# EAGLE schematic CHAIRI2C (EAGLE 9.6.2)
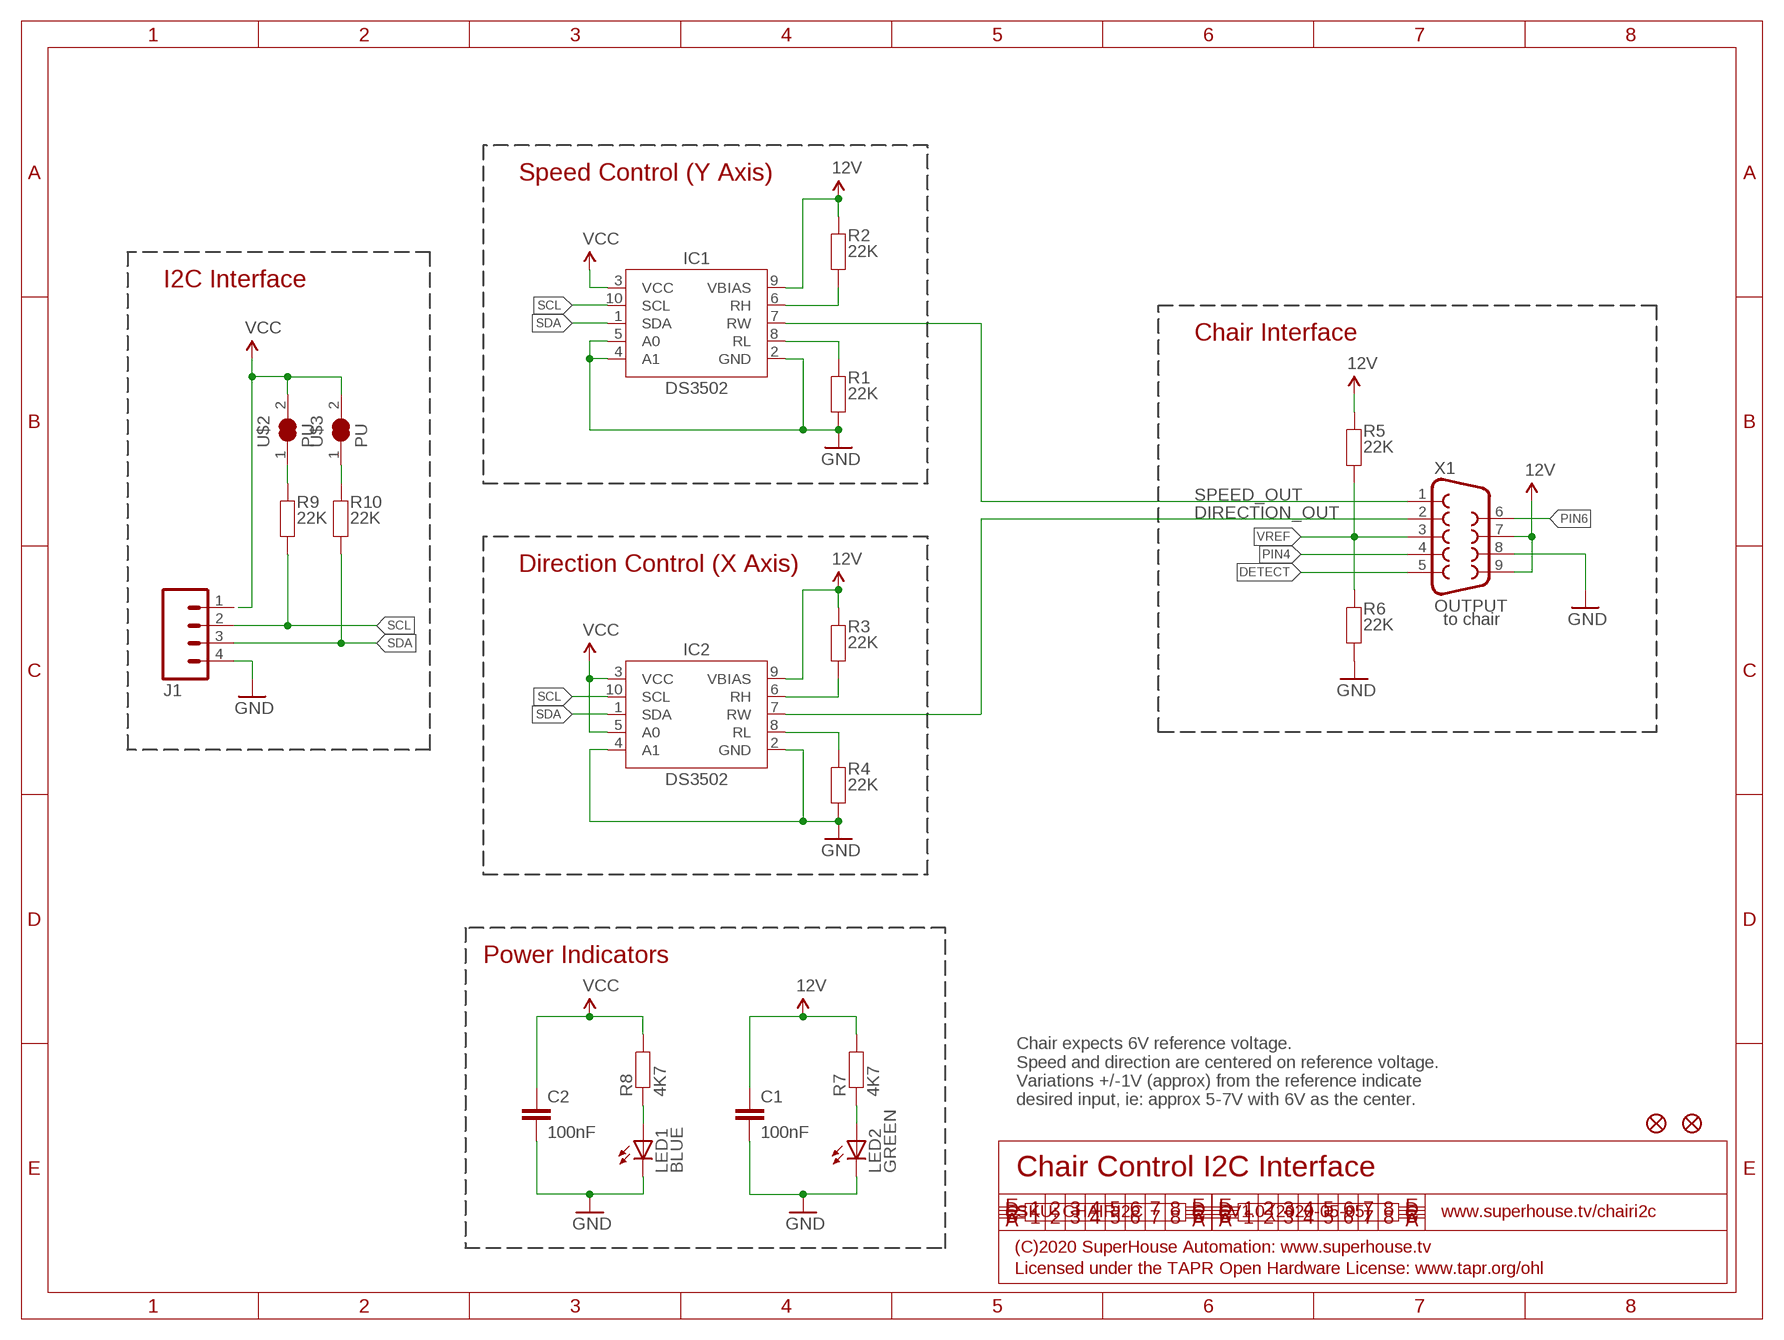
[diagram p0: schematic, sheet 1]

## Parts
C1  100nF  CAP0603  [C0603]
C2  100nF  CAP0603  [C0603]
IC1  DS3502  [MSOP10]
IC2  DS3502  [MSOP10]
J1  M04-PLAIN  [1X04]
LED1  BLUE  LED0603  [LED-0603]
LED2  GREEN  LED0603  [LED-0603]
R1  22K  RESISTOR0603  [R0603]
R2  22K  RESISTOR0603  [R0603]
R3  22K  RESISTOR0603  [R0603]
R4  22K  RESISTOR0603  [R0603]
R5  22K  RESISTOR0603  [R0603]
R6  22K  RESISTOR0603  [R0603]
R7  4K7  RESISTOR0603  [R0603]
R8  4K7  RESISTOR0603  [R0603]
R9  22K  RESISTOR0603  [R0603]
R10  22K  RESISTOR0603  [R0603]
U$2  PU  SJC-NORMAL  [SJC]
U$3  PU  SJC-NORMAL  [SJC]
U$8  FIDUCIAL1X2.5  [FIDUCIAL-1X2.5]
U$9  FIDUCIAL1X2.5  [FIDUCIAL-1X2.5]
X1  OUTPUT  DB9-PCB-SOCKET  [DB9-PCB-SOCKET]

## Nets
12V: C1.1 IC1.9(VBIAS) IC2.9(VBIAS) R2.2 R3.2 R5.2 R7.2 X1.7 X1.9
DETECT: X1.5
DIRECTION_OUT: IC2.7(RW) X1.2
GND: C1.2 C2.2 IC1.2(GND) IC1.4(A1) IC1.5(A0) IC2.2(GND) IC2.4(A1) J1.4 LED1.C LED2.C R1.1 R4.1 R6.1 X1.8
N$1: R9.2 U$2.1
N$2: IC1.6(RH) R2.1
N$3: IC2.6(RH) R3.1
N$4: IC1.8(RL) R1.2
N$5: LED1.A R8.1
N$6: LED2.A R7.1
N$8: R10.2 U$3.1
N$15: IC2.8(RL) R4.2
PIN4: X1.4
PIN6: X1.6
SCL: IC1.10(SCL) IC2.10(SCL) J1.2 R9.1
SDA: IC1.1(SDA) IC2.1(SDA) J1.3 R10.1
SPEED_OUT: IC1.7(RW) X1.1
VCC: C2.1 IC1.3(VCC) IC2.3(VCC) IC2.5(A0) J1.1 R8.2 U$2.2 U$3.2
VREF: R5.1 R6.2 X1.3

## Notes on the sheet
- Speed Control (Y Axis)
- I2C Interface
- Chair Interface
- Direction Control (X Axis)
- to chair
- Power Indicators
- Chair expects 6V reference voltage.
  Speed and direction are centered on reference voltage.
  Variations +/-1V (approx) from the reference indicate
  desired input, ie: approx 5-7V with 6V as the center.
- Chair Control I2C Interface
- SKU: CHAIRI2C | V1.0 (2020-05-05) | www.superhouse.tv/chairi2c
- (C)2020 SuperHouse Automation: www.superhouse.tv
- Licensed under the TAPR Open Hardware License: www.tapr.org/ohl

## Library data of the parts
C1 C2 = SuperHouse-DiscreteSemi:CAP: Capacitor Standard ceramic capacitor
IC1 IC2 = SuperHouse-ICs:DS3502: DS3502 I2C digital potentiometer
J1 = SuperHouse-Connectors:M04: 4-way header Standard 1x4 header, and screw terminal variations
LED1 LED2 = SuperHouse-LEDs:LED: LEDs Standard schematic elements and footprints for 5mm, 3mm, 1206, and 0603 sized LEDs. 5mm - Spark Fun Electronics SKU : COM-00529 (and others)
R1-R10 = SuperHouse-DiscreteSemi:RESISTOR: Resistor Standard resistors.
U$2 U$3 = SuperHouse-Jumpers:SJC: Solder jumper. Normally closed: does not need solder to close. Can be opened by cutting the track.
U$8 U$9 = SuperHouse-Symbols:FIDUCIAL: Fiducial Alignment Points Various fiducial points for machine vision alignment.
X1 = SuperHouse-Connectors:DB9: DB9 Connector